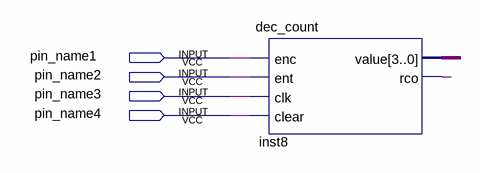
[diagram p0: schematic sheet]
// Quartus schematic YL_7SegmentDecoder2.bdf as structural Verilog: 1 symbols, 4 pins
module YL_7SegmentDecoder2 (
  input  pin_name1,
  input  pin_name2,
  input  pin_name3,
  input  pin_name4
);

  wire inst8_rco;
  wire [3:0] inst8_value;

  dec_count inst8 (
    .enc(pin_name1), .ent(pin_name2), .clk(pin_name3), .clear(pin_name4), .value(inst8_value), .rco(inst8_rco));
endmodule
